# EAGLE design MSSRP-Temperature_System_beta (EAGLE 6.6.0)
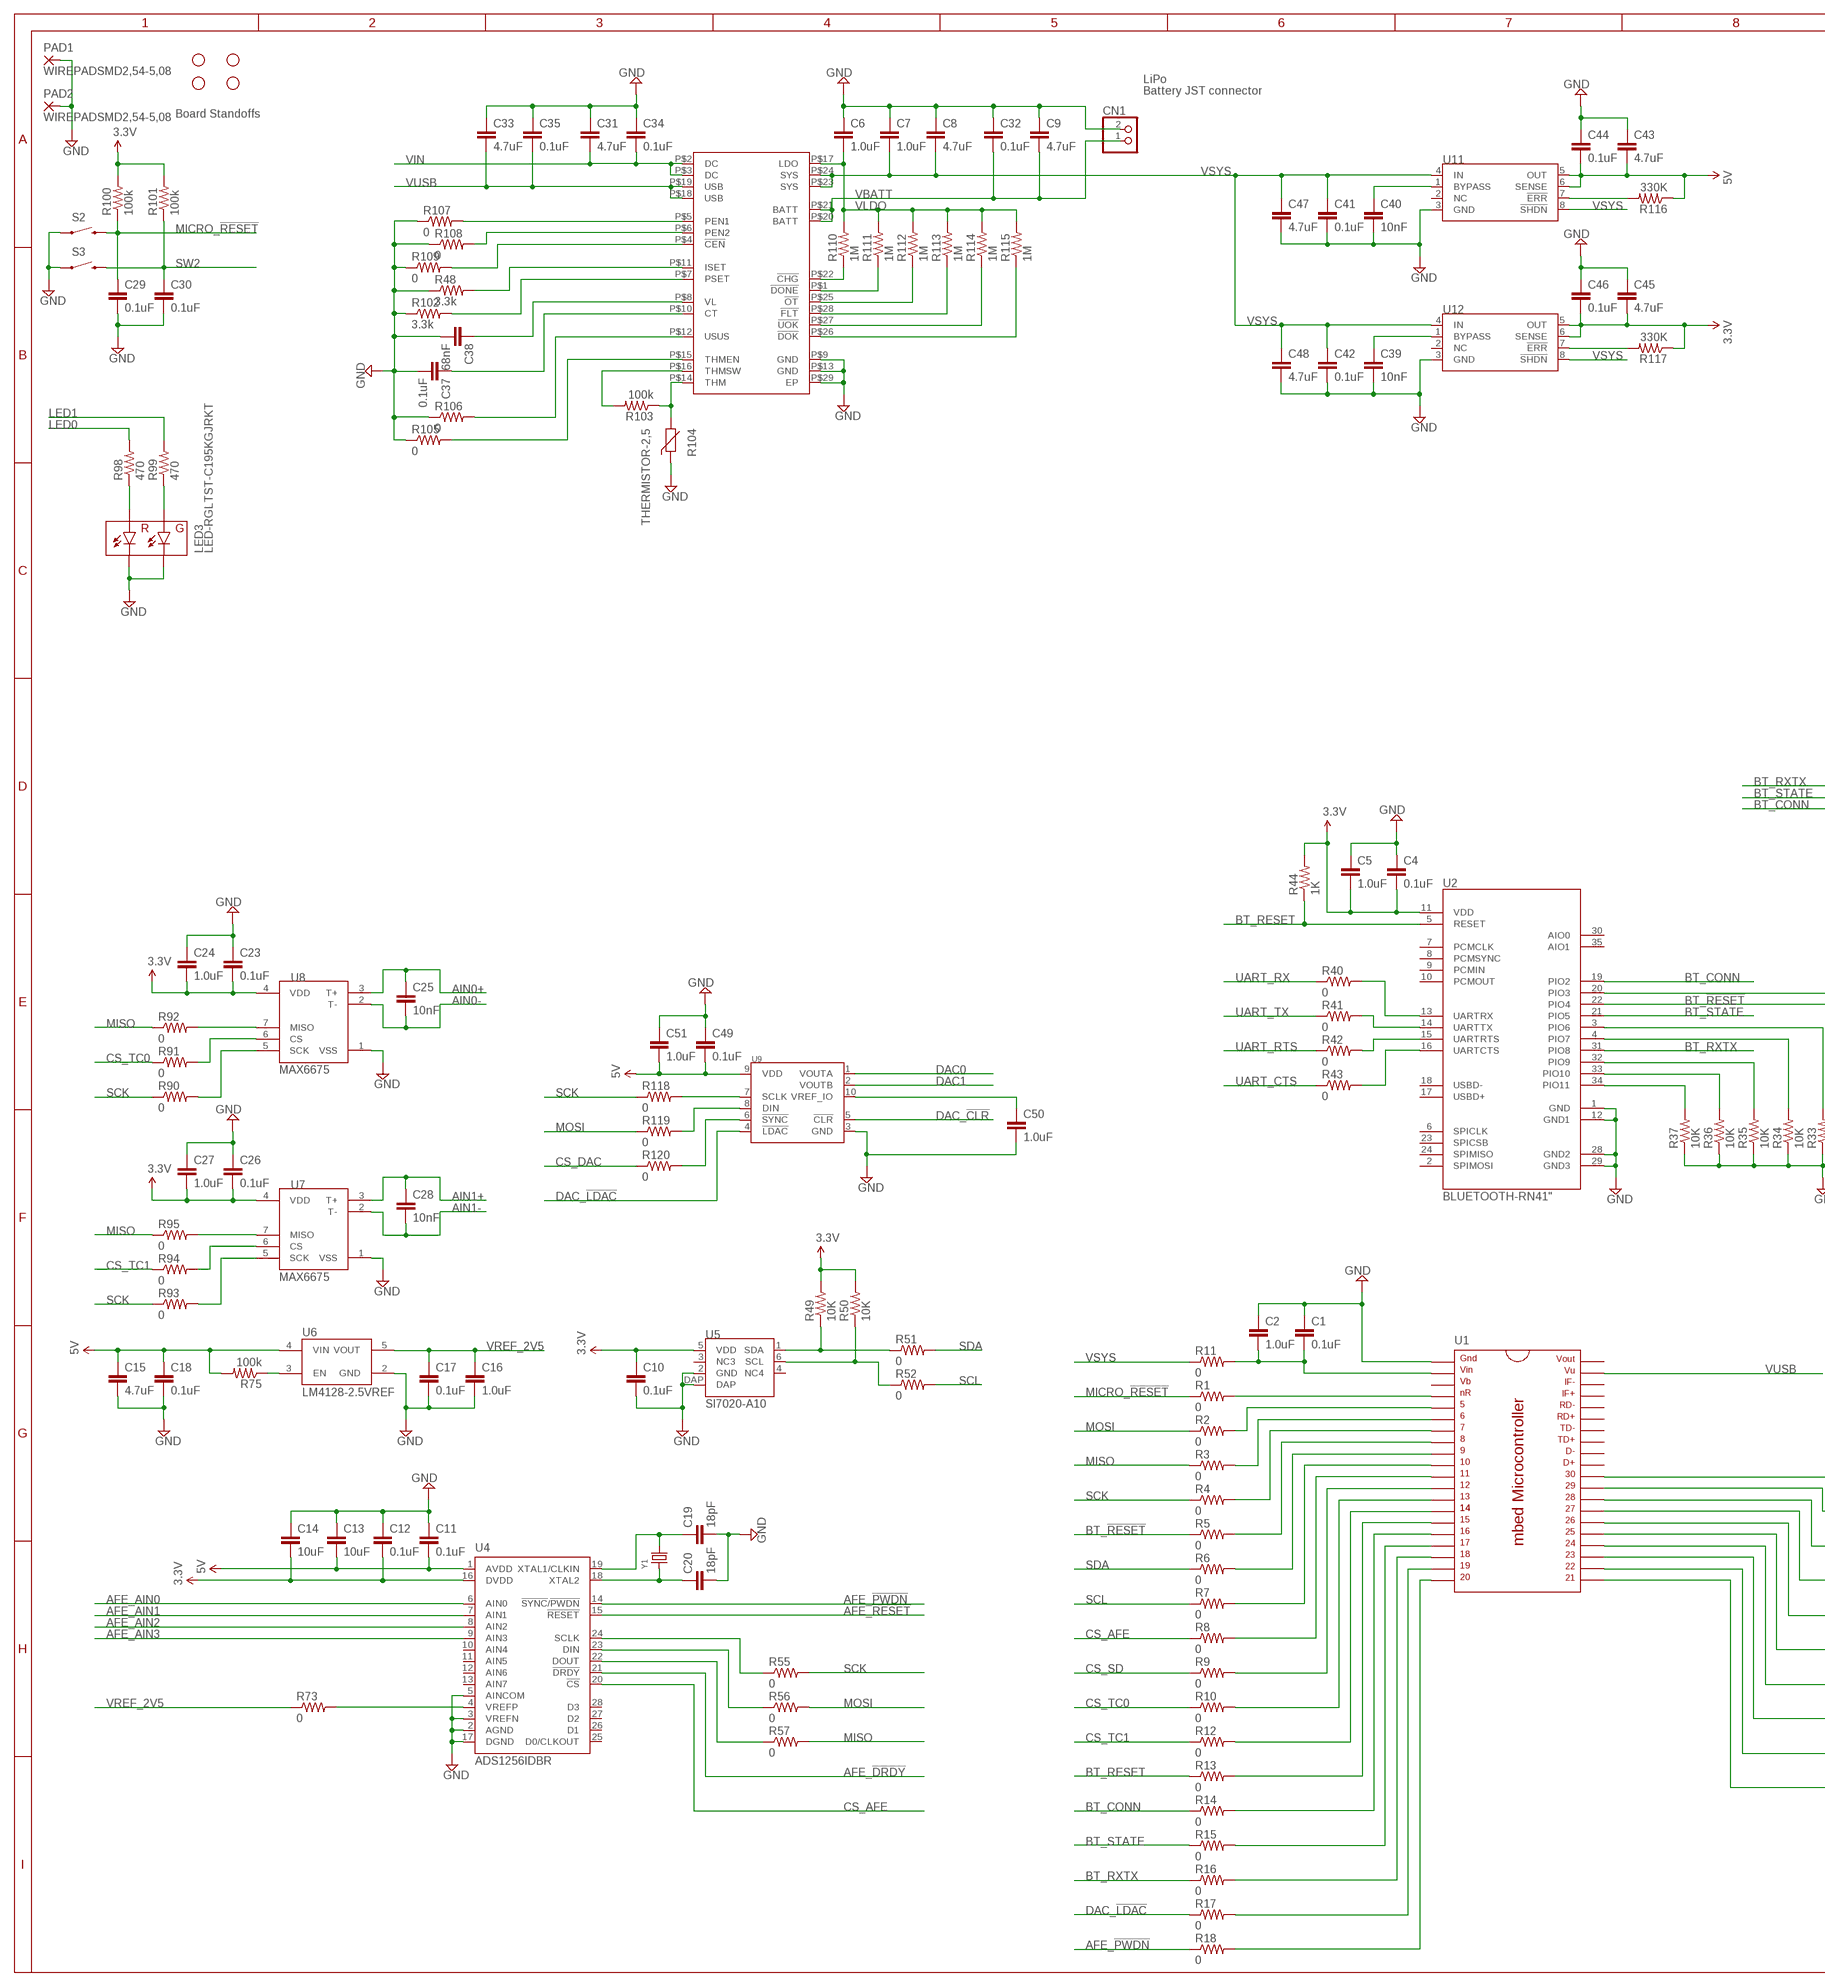
[diagram p0: schematic, sheet 1, part 1 of 2]
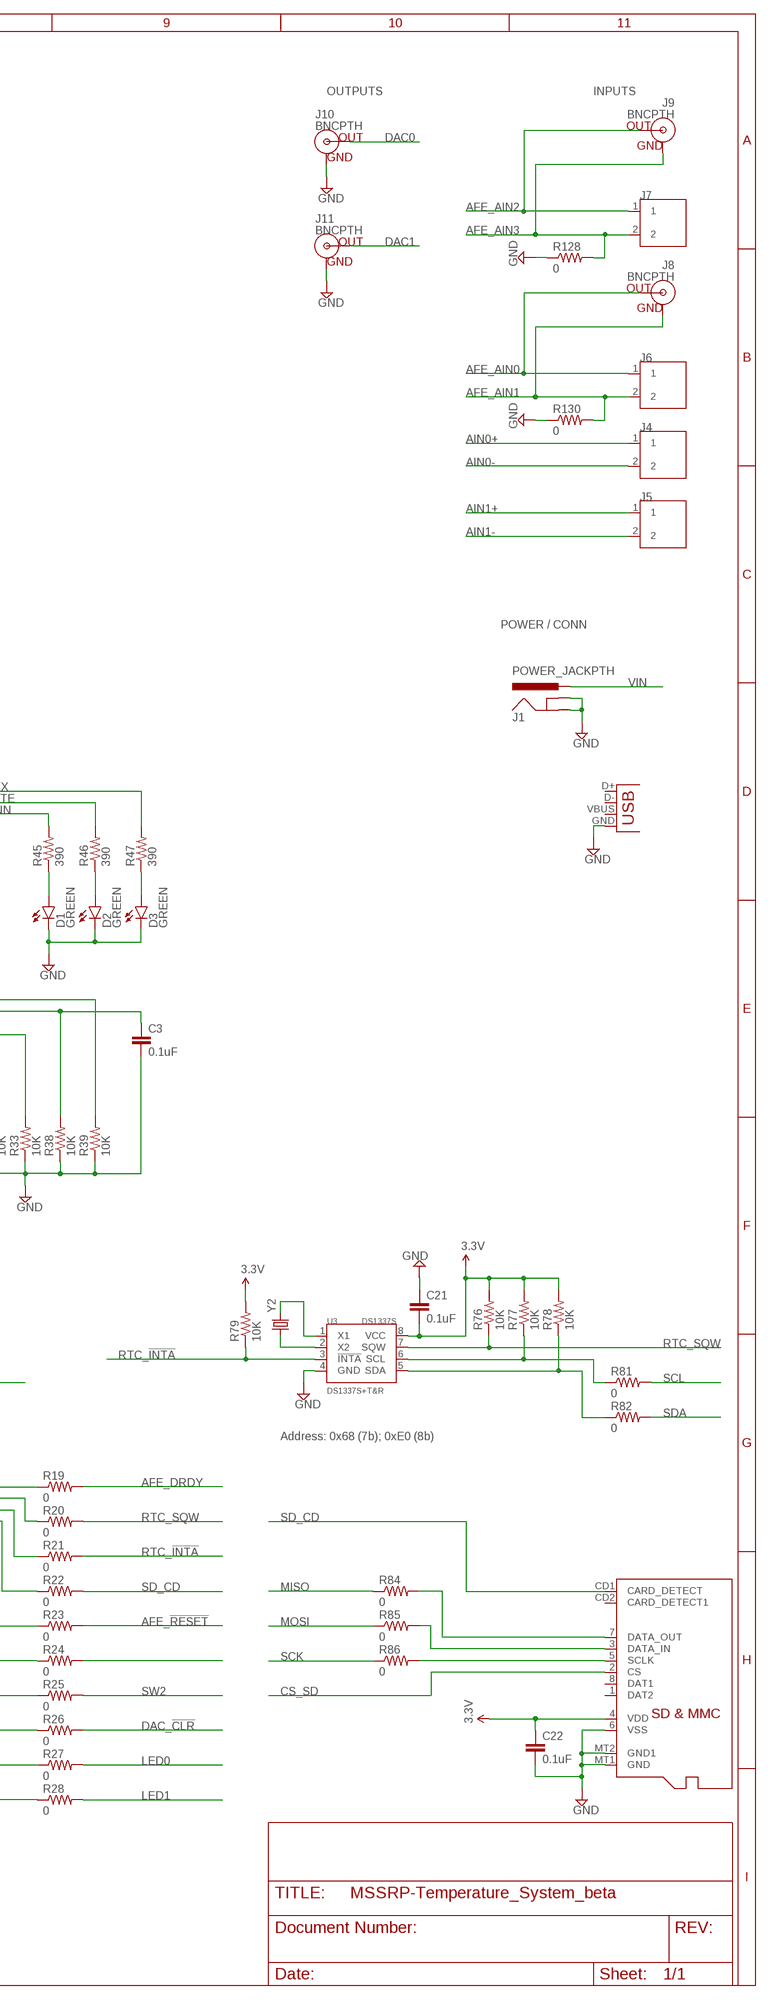
[diagram p1: schematic, sheet 1, part 2 of 2]

## Parts
C1  0.1uF  0.1UF-25V-5%(0603)  [0603-CAP]
C2  1.0uF  1.0UF-16V-10%(0603)  [0603-CAP]
C3  0.1uF  0.1UF-25V-5%(0603)  [0603-CAP]
C4  0.1uF  0.1UF-25V-5%(0603)  [0603-CAP]
C5  1.0uF  1.0UF-16V-10%(0603)  [0603-CAP]
C6  1.0uF  1.0UF-16V-10%(0603)  [0603-CAP]
C7  1.0uF  1.0UF-16V-10%(0603)  [0603-CAP]
C8  4.7uF  4.7UF-6.3V-10%(0603)0603  [0603-CAP]
C9  4.7uF  4.7UF-6.3V-10%(0603)0603  [0603-CAP]
C10  0.1uF  0.1UF-25V-5%(0603)  [0603-CAP]
C11  0.1uF  0.1UF-25V-5%(0603)  [0603-CAP]
C12  0.1uF  0.1UF-25V-5%(0603)  [0603-CAP]
C13  10uF  10UF-6.3V-20%(0603)  [0603-CAP]
C14  10uF  10UF-6.3V-20%(0603)  [0603-CAP]
C15  4.7uF  4.7UF-6.3V-10%(0603)0603  [0603-CAP]
C16  1.0uF  1.0UF-16V-10%(0603)  [0603-CAP]
C17  0.1uF  0.1UF-25V-5%(0603)  [0603-CAP]
C18  0.1uF  0.1UF-25V-5%(0603)  [0603-CAP]
C19  18pF  18PF-50V-5%(0603)  [0603-CAP]
C20  18pF  18PF-50V-5%(0603)  [0603-CAP]
C21  0.1uF  0.1UF-25V-5%(0603)  [0603-CAP]
C22  0.1uF  0.1UF-25V-5%(0603)  [0603-CAP]
C23  0.1uF  0.1UF-25V-5%(0603)  [0603-CAP]
C24  1.0uF  1.0UF-16V-10%(0603)  [0603-CAP]
C25  10nF  10NF/10000PF-50V-10%(0603)  [0603-CAP]
C26  0.1uF  0.1UF-25V-5%(0603)  [0603-CAP]
C27  1.0uF  1.0UF-16V-10%(0603)  [0603-CAP]
C28  10nF  10NF/10000PF-50V-10%(0603)  [0603-CAP]
C29  0.1uF  0.1UF-25V-5%(0603)  [0603-CAP]
C30  0.1uF  0.1UF-25V-5%(0603)  [0603-CAP]
C31  4.7uF  4.7UF-6.3V-10%(0603)0603  [0603-CAP]
C32  0.1uF  0.1UF-25V-5%(0603)  [0603-CAP]
C33  4.7uF  4.7UF-6.3V-10%(0603)0603  [0603-CAP]
C34  0.1uF  0.1UF-25V-5%(0603)  [0603-CAP]
C35  0.1uF  0.1UF-25V-5%(0603)  [0603-CAP]
C37  0.1uF  0.1UF-25V-5%(0603)  [0603-CAP]
C38  68nF  0.1UF-25V-5%(0603)  [0603-CAP]
C39  10nF  10NF/10000PF-50V-10%(0603)  [0603-CAP]
C40  10nF  10NF/10000PF-50V-10%(0603)  [0603-CAP]
C41  0.1uF  0.1UF-25V-5%(0603)  [0603-CAP]
C42  0.1uF  0.1UF-25V-5%(0603)  [0603-CAP]
C43  4.7uF  4.7UF-6.3V-10%(0603)0603  [0603-CAP]
C44  0.1uF  0.1UF-25V-5%(0603)  [0603-CAP]
C45  4.7uF  4.7UF-6.3V-10%(0603)0603  [0603-CAP]
C46  0.1uF  0.1UF-25V-5%(0603)  [0603-CAP]
C47  4.7uF  4.7UF-6.3V-10%(0603)0603  [0603-CAP]
C48  4.7uF  4.7UF-6.3V-10%(0603)0603  [0603-CAP]
C49  0.1uF  0.1UF-25V-5%(0603)  [0603-CAP]
C50  1.0uF  1.0UF-16V-10%(0603)  [0603-CAP]
C51  1.0uF  1.0UF-16V-10%(0603)  [0603-CAP]
CN1  JST_2PIN-THM-RA  [JST-PH-2-THM-RA]
D1  GREEN  LED-GREEN0603  [LED-0603]
D2  GREEN  LED-GREEN0603  [LED-0603]
D3  GREEN  LED-GREEN0603  [LED-0603]
J1  POWER_JACKPTH  [POWER_JACK_PTH]
J2  USBSMD  [USB-MINIB]
J4  TE-2-TERMBLOCK  [TE-2-TERMBLOCK]
J5  TE-2-TERMBLOCK  [TE-2-TERMBLOCK]
J6  TE-2-TERMBLOCK  [TE-2-TERMBLOCK]
J7  TE-2-TERMBLOCK  [TE-2-TERMBLOCK]
J8  BNCPTH  [BNC]
J9  BNCPTH  [BNC]
J10  BNCPTH  [BNC]
J11  BNCPTH  [BNC]
LED3  LED-RGLTST-C195KGJRKT  [LTST-C195KGJRKT]
PAD1  WIREPADSMD2,54-5,08  [SMD2,54-5,08]
PAD2  WIREPADSMD2,54-5,08  [SMD2,54-5,08]
R1  0  0OHM1/10W5%(0603)  [0603]
R2  0  0OHM1/10W5%(0603)  [0603]
R3  0  0OHM1/10W5%(0603)  [0603]
R4  0  0OHM1/10W5%(0603)  [0603]
R5  0  0OHM1/10W5%(0603)  [0603]
R6  0  0OHM1/10W5%(0603)  [0603]
R7  0  0OHM1/10W5%(0603)  [0603]
R8  0  0OHM1/10W5%(0603)  [0603]
R9  0  0OHM1/10W5%(0603)  [0603]
R10  0  0OHM1/10W5%(0603)  [0603]
R11  0  0OHM1/10W5%(0603)  [0603]
R12  0  0OHM1/10W5%(0603)  [0603]
R13  0  0OHM1/10W5%(0603)  [0603]
R14  0  0OHM1/10W5%(0603)  [0603]
R15  0  0OHM1/10W5%(0603)  [0603]
R16  0  0OHM1/10W5%(0603)  [0603]
R17  0  0OHM1/10W5%(0603)  [0603]
R18  0  0OHM1/10W5%(0603)  [0603]
R19  0  0OHM1/10W5%(0603)  [0603]
R20  0  0OHM1/10W5%(0603)  [0603]
R21  0  0OHM1/10W5%(0603)  [0603]
R22  0  0OHM1/10W5%(0603)  [0603]
R23  0  0OHM1/10W5%(0603)  [0603]
R24  0  0OHM1/10W5%(0603)  [0603]
R25  0  0OHM1/10W5%(0603)  [0603]
R26  0  0OHM1/10W5%(0603)  [0603]
R27  0  0OHM1/10W5%(0603)  [0603]
R28  0  0OHM1/10W5%(0603)  [0603]
R33  10K  10KOHM1/10W1%(0603)0603  [0603-RES]
R34  10K  10KOHM1/10W1%(0603)0603  [0603-RES]
R35  10K  10KOHM1/10W1%(0603)0603  [0603-RES]
R36  10K  10KOHM1/10W1%(0603)0603  [0603-RES]
R37  10K  10KOHM1/10W1%(0603)0603  [0603-RES]
R38  10K  10KOHM1/10W1%(0603)0603  [0603-RES]
R39  10K  10KOHM1/10W1%(0603)0603  [0603-RES]
R40  0  0OHM1/10W5%(0603)  [0603]
R41  0  0OHM1/10W5%(0603)  [0603]
R42  0  0OHM1/10W5%(0603)  [0603]
R43  0  0OHM1/10W5%(0603)  [0603]
R44  1K  1KOHM1/10W1%(0603)  [0603-RES]
R45  390  390OHM1/10W1%(0603)  [0603-RES]
R46  390  390OHM1/10W1%(0603)  [0603-RES]
R47  390  390OHM1/10W1%(0603)  [0603-RES]
R48  3.3k  3.3MOHM-1/10W-1%(0603)  [0603-RES]
R49  10K  10KOHM1/10W1%(0603)0603  [0603-RES]
R50  10K  10KOHM1/10W1%(0603)0603  [0603-RES]
R51  0  0OHM1/10W5%(0603)  [0603]
R52  0  0OHM1/10W5%(0603)  [0603]
R55  0  0OHM1/10W5%(0603)  [0603]
R56  0  0OHM1/10W5%(0603)  [0603]
R57  0  0OHM1/10W5%(0603)  [0603]
R73  0  0OHM1/10W5%(0603)  [0603]
R75  100k  100KOHM1/10W1%(0603)  [0603-RES]
R76  10K  10KOHM1/10W1%(0603)0603  [0603-RES]
R77  10K  10KOHM1/10W1%(0603)0603  [0603-RES]
R78  10K  10KOHM1/10W1%(0603)0603  [0603-RES]
R79  10K  10KOHM1/10W1%(0603)0603  [0603-RES]
R81  0  0OHM1/10W5%(0603)  [0603]
R82  0  0OHM1/10W5%(0603)  [0603]
R84  0  0OHM1/10W5%(0603)  [0603]
R85  0  0OHM1/10W5%(0603)  [0603]
R86  0  0OHM1/10W5%(0603)  [0603]
R90  0  0OHM1/10W5%(0603)  [0603]
R91  0  0OHM1/10W5%(0603)  [0603]
R92  0  0OHM1/10W5%(0603)  [0603]
R93  0  0OHM1/10W5%(0603)  [0603]
R94  0  0OHM1/10W5%(0603)  [0603]
R95  0  0OHM1/10W5%(0603)  [0603]
R98  470  470OHM1/10W1%(0603)  [0603-RES]
R99  470  470OHM1/10W1%(0603)  [0603-RES]
R100  100k  100KOHM1/10W1%(0603)  [0603-RES]
R101  100k  100KOHM1/10W1%(0603)  [0603-RES]
R102  3.3k  3.3MOHM-1/10W-1%(0603)  [0603-RES]
R103  100k  100OHM1/10W1%(0603)  [0603-RES]
R104  THERMISTOR-2,5  [RS-2,5]
R105  0  0OHM1/10W5%(0603)  [0603]
R106  0  0OHM1/10W5%(0603)  [0603]
R107  0  0OHM1/10W5%(0603)  [0603]
R108  0  0OHM1/10W5%(0603)  [0603]
R109  0  0OHM1/10W5%(0603)  [0603]
R110  1M  330KOHM1/10W1%(0603)0603  [0603-RES]
R111  1M  330KOHM1/10W1%(0603)0603  [0603-RES]
R112  1M  330KOHM1/10W1%(0603)0603  [0603-RES]
R113  1M  330KOHM1/10W1%(0603)0603  [0603-RES]
R114  1M  330KOHM1/10W1%(0603)0603  [0603-RES]
R115  1M  330KOHM1/10W1%(0603)0603  [0603-RES]
R116  330K  330KOHM1/10W1%(0603)0603  [0603-RES]
R117  330K  330KOHM1/10W1%(0603)0603  [0603-RES]
R118  0  0OHM1/10W5%(0603)  [0603]
R119  0  0OHM1/10W5%(0603)  [0603]
R120  0  0OHM1/10W5%(0603)  [0603]
R128  0  0OHM1/10W5%(0603)  [0603]
R130  0  0OHM1/10W5%(0603)  [0603]
S2  SWITCH-MOMENTARY-2-SMD-1101NE  [TACTILE-SWITCH-1101NE]
S3  SWITCH-MOMENTARY-2-SMD-1101NE  [TACTILE-SWITCH-1101NE]
STANDOFF1  STAND-OFF  [STAND-OFF]
STANDOFF2  STAND-OFF  [STAND-OFF]
STANDOFF3  STAND-OFF  [STAND-OFF]
STANDOFF4  STAND-OFF  [STAND-OFF]
U1  MBED  [DIL40_0.9]
U2  BLUETOOTH-RN41"  [RN41]
U3  DS1337S+T&R  [SOIC8]
U4  ADS1256IDBR  [SSOP28]
U5  SI7020-A10  [DFN6]
U6  LM4128-2.5VREF  [SOT23-5]
U7  MAX6675  [SO08-MAX6675]
U8  MAX6675  [SO08-MAX6675]
U9  DAC7562  [MSOP10]
U10  MAX8934A  [QFN28]
U11  LP2989AIM  [SOIC8]
U12  LP2989AIM  [SOIC8]
U$1  MICROSD  [MICROSD]
Y1  CRYSTALSMD  [HC49UP]
Y2  CRYSTALSMD  [HC49UP]

## Nets
3.3V: C4.2 C5.2 C10.1 C12.2 C14.2 C21.2 C22.1 C23.2 C24.2 C26.2 C27.2 C45.2 C46.2 R44.2 R49.2 R50.2 R76.2 R77.2 R78.2 R79.2 R100.2 R101.2 R117.1 U2.11(VDD) U3.8(VCC) U4.16(DVDD) U5.5(VDD) U7.4(VDD) U8.4(VDD) U12.5(OUT) U12.6(SENSE) U$1.4(VDD)
5V: C11.2 C13.2 C15.1 C18.1 C43.2 C44.2 C49.2 C51.2 R75.2 R116.1 U4.1(AVDD) U6.4(VIN) U9.9(VDD) U11.5(OUT) U11.6(SENSE)
AFE_!DRDY: U4.21(!DRDY)
AFE_!PWDN: R18.1 U4.14(!SYNC!/!PWDN)
AFE_!RESET: R23.2 U4.15(!RESET)
AFE_AIN0: J6.1 J8.S(OUT) U4.6(AIN0)
AFE_AIN1: J6.2 J8.GND R130.2 U4.7(AIN1)
AFE_AIN2: J7.1 J9.S(OUT) U4.8(AIN2)
AFE_AIN3: J7.2 J9.GND R128.2 U4.9(AIN3)
AFE_DRDY: R19.2
AIN0+: C25.1 J4.1 U8.3(T+)
AIN0-: C25.2 J4.2 U8.2(T-)
AIN1+: C28.1 J5.1 U7.3(T+)
AIN1-: C28.2 J5.2 U7.2(T-)
BT_!RESET: C3.1 R5.1 R38.2 U2.22(PIO4)
BT_CONN: R14.1 R45.2 U2.19(PIO2)
BT_RESET: R13.1 R44.1 U2.5(RESET)
BT_RXTX: R16.1 R47.2 U2.31(PIO8)
BT_STATE: R15.1 R46.2 U2.21(PIO5)
CS_AFE: R8.1 U4.20(!CS)
CS_DAC: R120.1
CS_SD: R9.1 U$1.2(CS)
CS_TC0: R10.1 R91.1
CS_TC1: R12.1 R94.1
DAC0: J10.S(OUT) U9.1(VOUTA)
DAC1: J11.S(OUT) U9.2(VOUTB)
DAC_!CLR: R26.2 U9.5(!CLR)
DAC_!LDAC: R17.1 U9.4(!LDAC)
GND: C1.1 C2.1 C3.2 C4.1 C5.1 C6.1 C7.1 C8.1 C9.1 C10.2 C11.1 C12.1 C13.1 C14.1 C15.2 C16.2 C17.2 C18.2 C19.2 C20.2 C21.1 C22.2 C23.1 C24.1 C26.1 C27.1 C29.2 C30.2 C31.1 C32.1 C33.1 C34.1 C35.1 C37.2 C38.2 C39.2 C40.2 C41.2 C42.2 C43.1 C44.1 C45.1 C46.1 C47.2 C48.2 C49.1 C50.2 C51.1 CN1.2 D1.C D2.C D3.C J1.GND J1.GNDBREAK J2.GND J10.GND J11.GND LED3.P$3(GC) LED3.P$4(RC) PAD1.1(P) PAD2.1(P) R33.1 R34.1 R35.1 R36.1 R37.1 R38.1 R39.1 R48.1 R102.1 R104.1 R105.1 R106.1 R107.1 R108.1 R109.1 R128.1 R130.1 S2.P$1 S3.P$1 U1.1 U2.1(GND) U2.12(GND1) U2.28(GND2) U2.29(GND3) U3.4(GND) U4.2(AGND) U4.3(VREFN) U4.5(AINCOM) U4.17(DGND) U5.2(GND) U5.DAP U6.2(GND) U7.1(VSS) U8.1(VSS) U9.3(GND) U10.P$9(GND) U10.P$13(GND) U10.P$29(EP) U11.3(GND) U12.3(GND) U$1.6(VSS) U$1.MT1(GND) U$1.MT2(GND1)
LED0: R27.2 R98.2
LED1: R28.2 R99.2
MICRO_!RESET: C29.1 R1.1 R100.1 S2.P$2
MISO: R3.1 R57.2 R84.1 R92.1 R95.1
MOSI: R2.1 R56.2 R85.1 R119.1
N$1: R1.2 U1.4
N$2: R2.2 U1.5
N$3: R3.2 U1.6
N$4: R4.2 U1.7
N$5: R5.2 U1.8
N$6: R6.2 U1.9
N$7: R7.2 U1.10
N$8: C1.2 C2.2 R11.2 U1.2
N$9: R8.2 U1.11
N$10: R9.2 U1.12
N$11: R10.2 U1.13
N$12: R12.2 U1.14
N$13: R19.1 U1.30
N$14: R13.2 U1.15
N$15: R20.1 U1.29
N$16: R21.1 U1.28
N$17: R22.1 U1.27
N$18: R23.1 U1.26
N$19: R24.1 U1.25
N$20: R14.2 U1.16
N$21: R15.2 U1.17
N$22: R16.2 U1.18
N$23: R17.2 U1.19
N$24: R18.2 U1.20
N$25: R25.1 U1.24
N$26: R26.1 U1.23
N$27: R27.1 U1.22
N$28: R28.1 U1.21
N$30: R24.2
N$33: R34.2 U2.4(PIO7)
N$34: R33.2 U2.3(PIO6)
N$35: R35.2 U2.32(PIO9)
N$36: R36.2 U2.33(PIO10)
N$37: R37.2 U2.34(PIO11)
N$39: R39.2 U2.20(PIO3)
N$40: R41.2 U2.14(UARTTX)
N$41: R42.2 U2.15(UARTRTS)
N$42: R43.2 U2.16(UARTCTS)
N$43: R40.2 U2.13(UARTRX)
N$44: D1.A R45.1
N$45: D2.A R46.1
N$46: D3.A R47.1
N$47: R49.1 R51.1 U5.1(SDA)
N$48: R50.1 R52.1 U5.6(SCL)
N$51: R55.1 U4.24(SCLK)
N$52: R56.1 U4.23(DIN)
N$53: R57.1 U4.22(DOUT)
N$69: R73.2 U4.4(VREFP)
N$71: R75.1 U6.3(EN)
N$72: C20.1 U4.18(XTAL2) Y1.1
N$73: C19.1 U4.19(XTAL1/CLKIN) Y1.2
N$74: U3.2(X2) Y2.1
N$75: U3.1(X1) Y2.2
N$77: R77.1 R81.1 U3.6(SCL)
N$78: R78.1 R82.1 U3.5(SDA)
N$81: R86.2 U$1.5(SCLK)
N$82: R85.2 U$1.3(DATA_IN)
N$83: R84.2 U$1.7(DATA_OUT)
N$86: R92.2 U8.7(MISO)
N$87: R91.2 U8.6(CS)
N$88: R90.2 U8.5(SCK)
N$89: R95.2 U7.7(MISO)
N$90: R94.2 U7.6(CS)
N$91: R93.2 U7.5(SCK)
N$92: LED3.P$2(RA) R98.1
N$93: LED3.P$1(GA) R99.1
N$97: R103.1 R104.2 U10.P$14(THM)
N$98: R103.2 U10.P$16(THMSW)
N$99: R105.2 U10.P$15(THMEN)
N$100: R106.2 U10.P$12(USUS)
N$101: R107.2 U10.P$5(PEN1)
N$102: R108.2 U10.P$6(PEN2)
N$103: R109.2 U10.P$4(!CEN)
N$104: R48.2 U10.P$11(ISET)
N$105: R102.2 U10.P$7(PSET)
N$106: C38.1 U10.P$8(VL)
N$107: C37.1 U10.P$10(CT)
N$109: R110.1 U10.P$22(!CHG)
N$110: R111.1 U10.P$1(!DONE)
N$111: R112.1 U10.P$25(!OT)
N$112: R113.1 U10.P$28(!FLT)
N$113: R114.1 U10.P$27(!UOK)
N$114: R115.1 U10.P$26(!DOK)
N$115: C40.1 U11.1(BYPASS)
N$116: C39.1 U12.1(BYPASS)
N$117: R116.2 U11.7(!ERR)
N$118: R117.2 U12.7(!ERR)
N$119: R118.2 U9.7(SCLK)
N$120: R119.2 U9.8(DIN)
N$121: R120.2 U9.6(!SYNC)
N$124: C50.1 U9.10(VREF_IO)
RTC_!INTA: R21.2 R79.1 U3.3(!INTA)
RTC_SQW: R20.2 R76.1 U3.7(SQW)
SCK: R4.1 R55.2 R86.1 R90.1 R93.1 R118.1
SCL: R7.1 R52.2 R81.2
SD_CD: R22.2 U$1.CD1(CARD_DETECT)
SDA: R6.1 R51.2 R82.2
SW2: C30.1 R25.2 R101.1 S3.P$2
UART_CTS: R43.1
UART_RTS: R42.1
UART_RX: R40.1
UART_TX: R41.1
VBATT: C9.2 C32.2 CN1.1 U10.P$20(BATT) U10.P$21(BATT)
VIN: C31.2 C34.2 J1.PWR U10.P$2(DC) U10.P$3(DC)
VLDO: C6.2 R110.2 R111.2 R112.2 R113.2 R114.2 R115.2 U10.P$17(LDO)
VREF_2V5: C16.1 C17.1 R73.1 U6.5(VOUT)
VSYS: C7.2 C8.2 C41.1 C42.1 C47.1 C48.1 R11.1 U10.P$23(SYS) U10.P$24(SYS) U11.4(IN) U11.8(!SHDN) U12.4(IN) U12.8(!SHDN)
VUSB: C33.2 C35.2 U1.39 U10.P$18(USB) U10.P$19(USB)
Unconnected: J2.D+ J2.D- J2.VBUS U1.3 U1.31 U1.32 U1.33 U1.34 U1.35 U1.36 U1.37 U1.38 U1.40 U2.2(SPIMOSI) U2.6(SPICLK) U2.7(PCMCLK) U2.8(PCMSYNC) U2.9(PCMIN) U2.10(PCMOUT) U2.17(USBD+) U2.18(USBD-) U2.23(SPICSB) U2.24(SPIMISO) U2.30(AIO0) U2.35(AIO1) U4.10(AIN4) U4.11(AIN5) U4.12(AIN6) U4.13(AIN7) U4.25(D0/CLKOUT) U4.26(D1) U4.27(D2) U4.28(D3) U5.3(NC3) U5.4(NC4) U11.2(NC) U12.2(NC) U$1.1(DAT2) U$1.8(DAT1) U$1.CD2(CARD_DETECT1)

## Notes on the sheet
- LiPo
- Battery JST connector | OUTPUTS | INPUTS
- Board Standoffs
- POWER / CONN
- Address: 0x68 (7b); 0xE0 (8b)

## Library data of the parts
C1 C3 C4 C10-C12 C17 C18 C21-C23 C26 C29 C30 C32 C34 C35 C37 C41 C42 C44 C46 C49 = SparkFun-Capacitors:0.1UF-25V-5%(0603): CAP-08604; PROD_ID: CAP-08604
C2 C5-C7 C16 C24 C27 C50 C51 = SparkFun-Capacitors:1.0UF-16V-10%(0603): CAP-00868; PROD_ID: CAP-00868
C8 C9 C15 C31 C33 C43 C45 C47 C48 = SparkFun-Capacitors:4.7UF-6.3V-10%(0603): CAP-08280; PROD_ID: CAP-08280
C13 C14 = SparkFun-Capacitors:10UF-6.3V-20%(0603): CAP-11015; PROD_ID: CAP-11015
C19 C20 = SparkFun-Capacitors:18PF-50V-5%(0603): CAP-08267; PROD_ID: CAP-08267
C25 C28 C39 C40 = SparkFun-Capacitors:10NF/10000PF-50V-10%(0603): CAP-00867; PROD_ID: CAP-00867
C38 = SparkFun-Capacitors:0.1UF-25V-5%(0603): CAP-08604; PROD_ID: CAP-08604; VALUE: 0.1uF
CN1 = adafruit:JST_2PIN: JST 2-Pin Connectors of various flavors SMT-RA (S2B-PH-SM4) 4UConnector #17311 SMT (B2B-PH-SM4) THM-RA (S2B-PH) THM (B2B-PH)
D1-D3 = SparkFun-LED:LED-GREEN: Various green LEDs Green LEDs used in SFE Production 0603- DIO-00821 LARGE- DIO-00862 LILYPAD- DIO-09910; PROD_ID: DIO-00821
J1 = SparkFun-Connectors:POWER_JACK: Power Jack This is the standard 5.5mm barrel jack for power. The PTH is the most common, proven, reliable, footprint. The Slot footprint only works if the mill layer is transmitted to the PCB fab house so be warned. Mating wall wart : TOL-00298 (and others); PROD_ID: PRT-00119
J2 = SparkFun-Connectors:USB: USB Connectors USB-B-PTH is fully proven SKU : PRT-00139/CONN-08278 USB-miniB is fully proven SKU : PRT-00587 USB-A-PCB is untested. USB-A-H is throughly reviewed, but untested. Spark Fun Electronics SKU : PRT-00437 USB-B-SMT is throughly reviewed, but untested. Needs silkscreen touching up. USB-A-S has not been used/tested USB-MB-H has not been used/tested USB-MICROB has been used. CONN-09505; PROD_ID: CONN-08193
J4-J7 = MSSRP-Lib:TE-2-TERMBLOCK
J8-J11 = SparkFun-Connectors:BNC: BNC Connector, Mouser Part# 5227161
LED3 = SparkFun-LED:LED-RG; PROD_ID: DIO-12140
PAD1 PAD2 = wirepad:WIREPAD: Wire PAD connect wire on PCB
R1-R28 R40-R43 R51 R52 R55-R57 R73 R81 R82 R84-R86 R90-R95 R105-R109 R118-R120 R128 R130 = SparkFun-Resistors:0OHM1/10W5%(0603): RES-08609; PROD_ID: RES-08609
R33-R39 R49 R50 R76-R79 = SparkFun-Resistors:10KOHM1/10W1%(0603): RES-00824; PROD_ID: RES-00824
R44 = SparkFun-Resistors:1KOHM1/10W1%(0603): RES-07856; PROD_ID: RES-07856
R45-R47 = SparkFun-Resistors:390OHM1/10W1%(0603): RES-07864; PROD_ID: RES-07864
R48 R102 = SparkFun-Resistors:3.3MOHM-1/10W-1%(0603): RES-11057; PROD_ID: RES-11057
R75 R100 R101 = SparkFun-Resistors:100KOHM1/10W1%(0603): RES-07828; PROD_ID: RES-07828
R98 R99 = SparkFun-Resistors:470OHM1/10W1%(0603): RES-07869; PROD_ID: RES-07869
R103 = SparkFun-Resistors:100OHM1/10W1%(0603): RES-07863; PROD_ID: RES-07863; VALUE: 100
R104 = varistor:THERMISTOR: THERMISTOR
R110-R115 = SparkFun-Resistors:330KOHM1/10W1%(0603): RES-08968; PROD_ID: RES-08968; VALUE: 330K
R116 R117 = SparkFun-Resistors:330KOHM1/10W1%(0603): RES-08968; PROD_ID: RES-08968
S2 S3 = SparkFun-Electromechanical:SWITCH-MOMENTARY-2: Various NO switches- pushbuttons, reed, etc
STANDOFF1-STANDOFF4 = SparkFun-Electromechanical:STAND-OFF: #4 Stand Off This is the mechanical footprint for a #4 phillips button head screw. Use the keepout ring to avoid running the screw head into surrounding components. SKU : PRT-00447
U1 = microbuilder:MBED: mbed Microcontroller, DIP40, 0.9"
U2 = SparkFun-RF:BLUETOOTH-RN41: Bluetooth SMD module
U3 = MSSRP-Lib:DS1337S+T&R
U4 = MSSRP-Lib:ADS1256
U5 = MSSRP-Lib:SI7020
U6 = SparkFun-PowerIC:LM4128-2.5VREF: .1% accurate low-current voltage reference
U7 U8 = SparkFun-AnalogIC:MAX6675: K-type thermocouple ADC, SPI output
U9 = MSSRP-Lib:DAC7562
U10 = MSSRP-Lib:MAX8934
U11 U12 = MSSRP-Lib:LP2989
U$1 = adafruit:MICROSD: Micro-SD / Transflash card holder with SPI pinout For the 3M # 2908-05WB-MG and/or 4UCON #19656 push-push type
Y1 = microbuilder:CRYSTAL: Crystals HC49UP - Surface Mount Crystal 4.0MHz 18pF +/-30ppm Surface Mount Crystal [Digikey: 535-9857-1-ND] 12.0 MHz Surface Mount Crystal [Digikey: 535-9869-6-ND] 25.0 MHz Surface Mount Crystal [Digikey: 535-9078-1-ND] 2.5 x 2.0mm - MEMs SMT Crystal 16.0 MHz 10pF 20ppm 2.5 x 2.0mm Crystal [Digikey -40-85°C: 535-10923-1-ND] 3.2 x 2.5mm - MEMs SMT Crystal 12.0 MHz 8pF 15ppm 3.2 x 2.5mm Crystal [Digikey: -10-70°C: 644-1047-1-ND -40-125°C: 644-1128-1-ND] 16.0 MHz 8pF 15ppm 3.2 x 2.5mm Crystal [Digikey: -10-70°C: 644-1049-1-ND -40-125°C: 644-1129-2-ND] 16.0 MHz 10pF 10ppm 3.2 x 2.5mm Crystal [Digikey: 644-1100-1-ND] 27.12 MHz 18pF 30ppm 3.2 x 2.5mm Crystal [Digikey: 887-1424-1-ND] 27.12MHz 10pF 10ppm 3.2 x 2.5mm Crystal [Digikey: 887-1329-1-ND] 4.9 x 1.8mm - MEMs SMT Crystal 32.768 KHz 12.5pF 20ppm 4.9 x 1.8mm Crystal [Digikey: SE2415CT-ND] 8.0 x 3.8mm - Surface Mount Crystal 32.768kHz 12.5pF 20ppm -40°C-85°C [Digikey: 535-9166-2-ND] Cylinder 32.768KHz Cylinder Crystal (2x6mm body) [Ex. Digikey: 300-8341-2-ND]
Y2 = SparkFun-FreqCtrl:CRYSTAL: Various standard crystals. Proven footprints. Spark Fun Electronics SKU : COM-00534

## Board
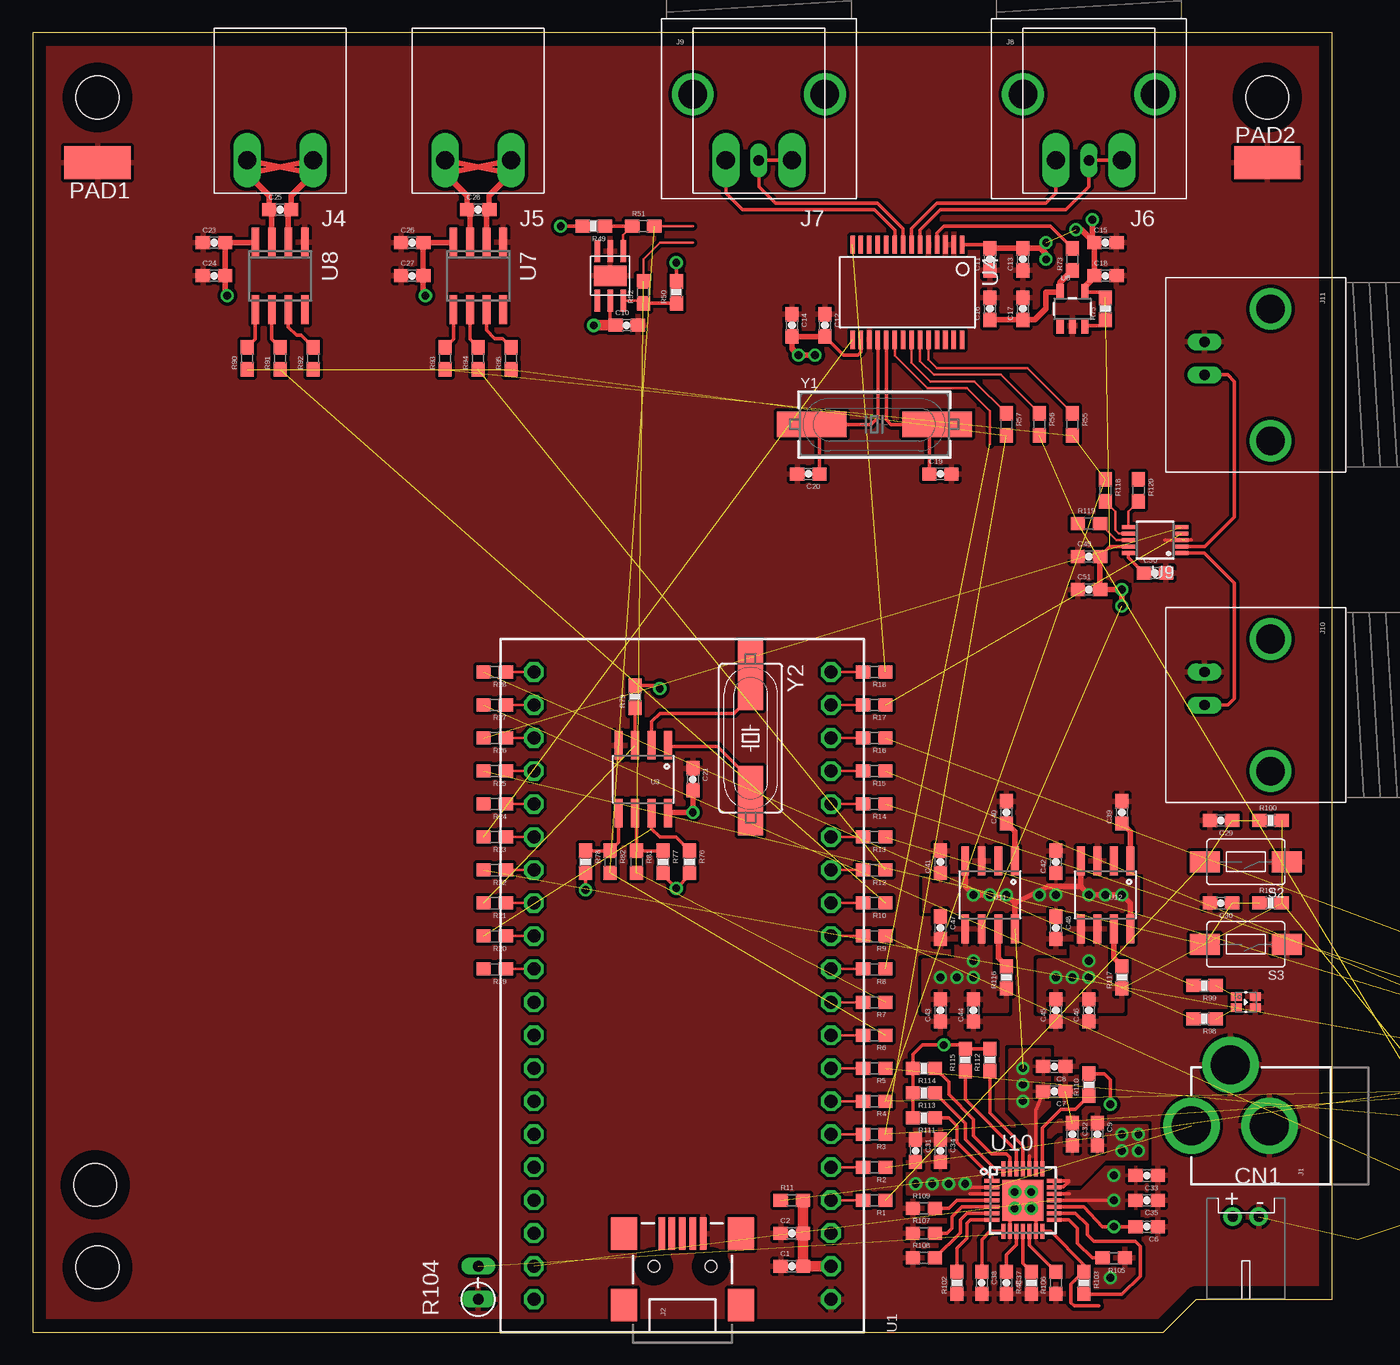
[diagram p2: board, top side]
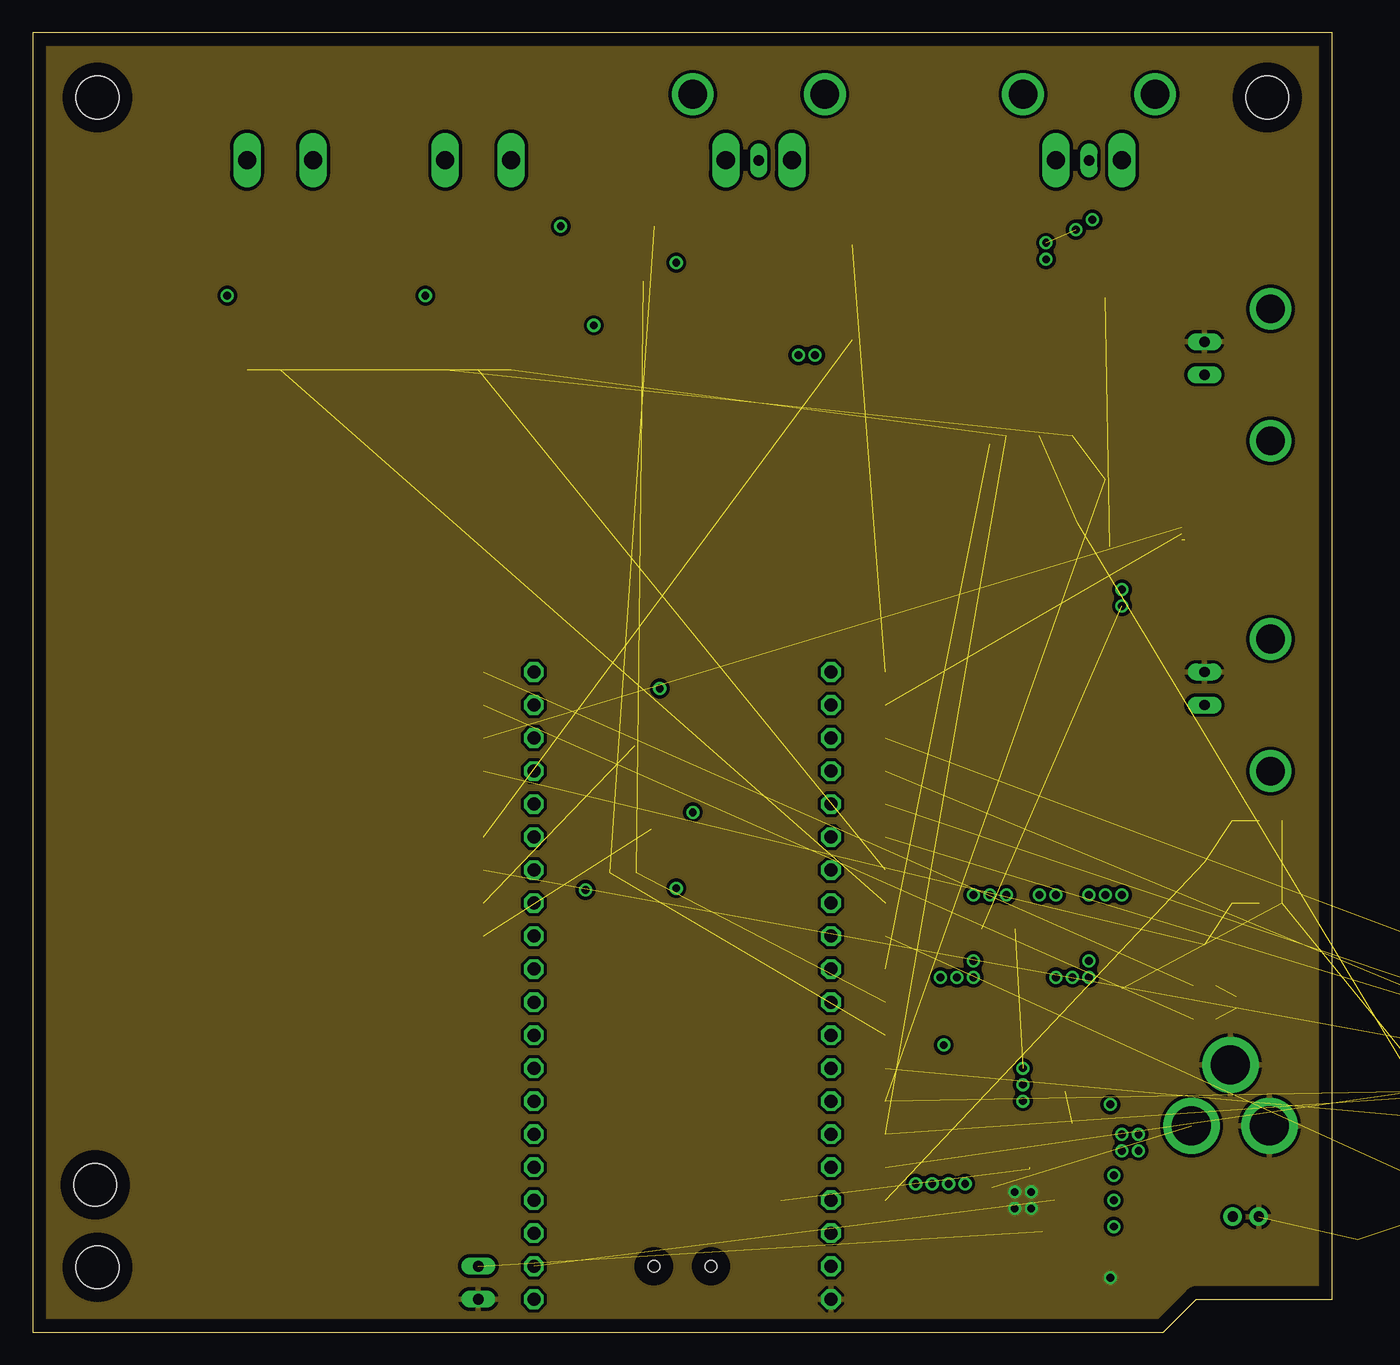
[diagram p3: board, inner layer Route2]
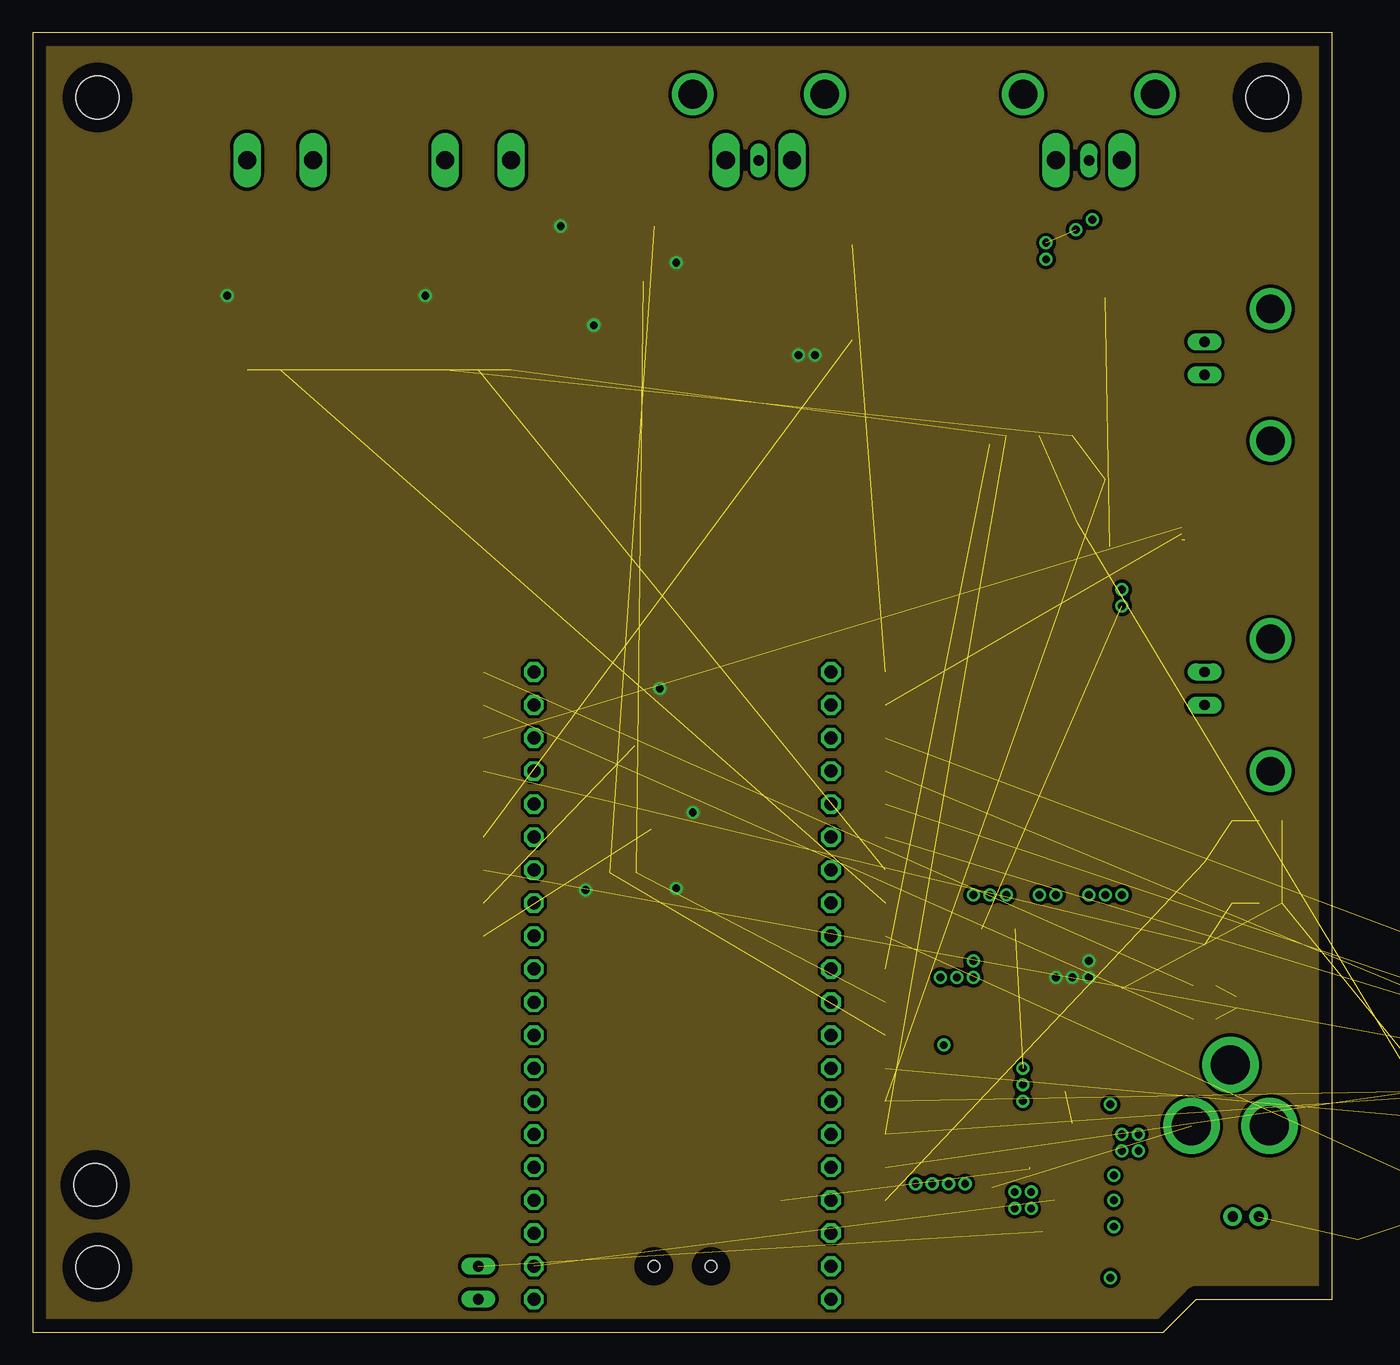
[diagram p4: board, inner layer Route15]
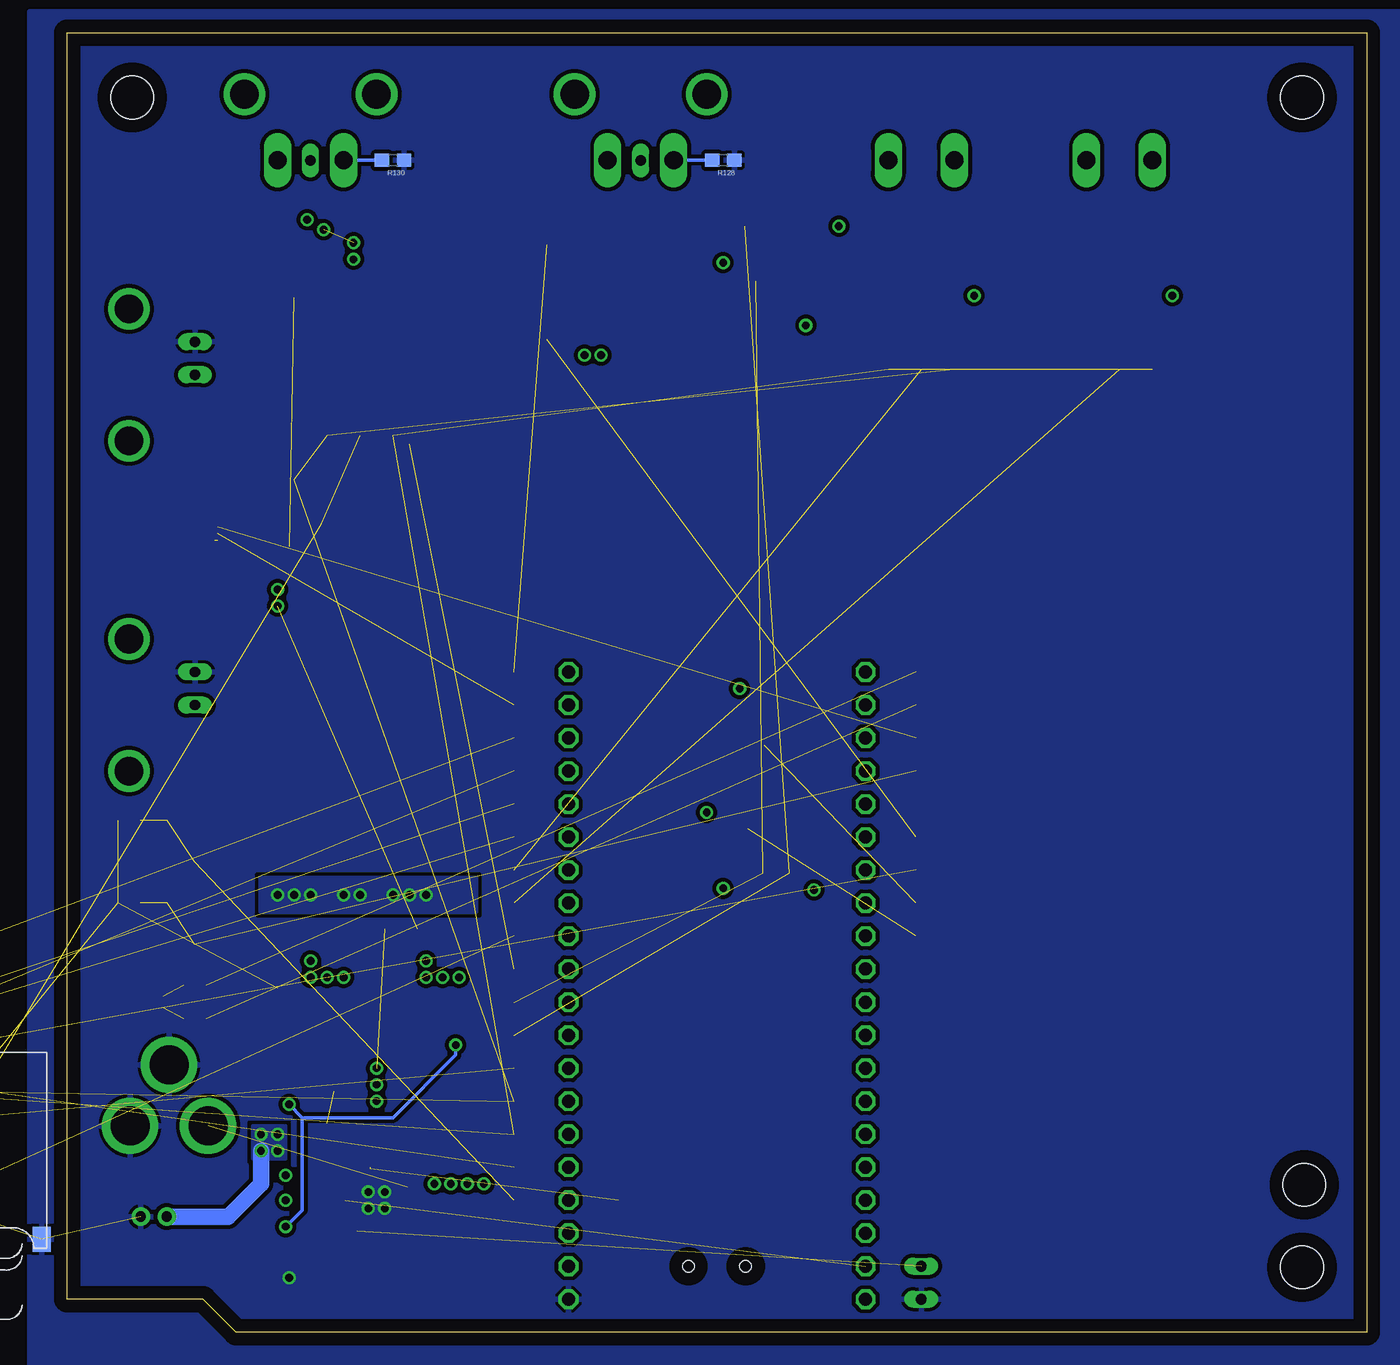
[diagram p5: board, bottom side, seen from below]

Size 100 x 100 mm. Coordinates in mm from the lower left corner, seen from the top.
Outline: 0,0 87,0 89.53,2.54 100,2.54 100,100 0,100 0,0
Copper layers (1*16): Top 0.035mm / dielectric 1.5mm / Bottom 0.035mm
Design rules "default": minimum track width 10mil, minimum drill 24mil, track to track 8mil, track to pad 8mil, pad to pad 8mil, via to via 8mil, smd to smd 8mil, copper to edge 40mil, drill to drill 8mil, minimum pad ring 10mil, minimum via ring 8mil, stop-mask expansion 4mil, vias tented up to drill 0mil, thermal gap 10mil

### Footprints (pad centres in the part's own frame; a part is rotated, then mirrored left to right if it is on the bottom)
0603-CAP = smd 1.1 x 1: 1 -0.85,0; 2 0.85,0
JST-PH-2-THM-RA = drill 0.8 pad 1.422: 1 1,0; 2 -1,0
LED-0603 = smd 1 x 1: A 0,-0.877; C 0,0.877
POWER_JACK_PTH = drill 2.997 pad 4.318: GND 0,7.7; GNDBREAK 4.7,10.7; PWR 0,13.7
USB-MINIB = smd 2.5 x 0.5: D+ 2.5,0; D- 2.5,0.8; GND 2.5,-1.6; ID 2.5,-0.8; VBUS 2.5,1.6 | smd 2.5 x 2: MTN1 -3,4.5; MTN2 2.5,4.5; MTN3 -3,-4.5; MTN4 2.5,-4.5 | hole 0.9: 0,2.2; 0,-2.2
TE-2-TERMBLOCK = drill 1.4 long: 1 -2.54,0; 2 2.54,0
BNC = drill 2.2: 3 -5.08,5.08; 4 5.08,5.08 | drill 0.8 long: GND -2.54,0; S 0,0
LTST-C195KGJRKT = smd 0.65 x 0.85: P$1 0.425,0.725; P$2 -0.425,0.725; P$3 0.425,-0.725; P$4 -0.425,-0.725
SMD2,54-5,08 = smd 2.54 x 5.08: 1 0,0
0603 = smd 1.1 x 1: 1 -0.85,0; 2 0.85,0
0603-RES = smd 1.1 x 1: 1 -0.85,0; 2 0.85,0
RS-2,5 = drill 0.813 long: 1 -1.27,0; 2 1.27,0
TACTILE-SWITCH-1101NE = smd 2.3 x 1.6: P$1 -3.15,0; P$2 3.15,0
STAND-OFF = hole 3.302: 0,0
DIL40_0.9 = drill 1 pad 1.397 octagon: 1 -22.86,-11.43; 2 -20.32,-11.43; 3 -17.78,-11.43; 4 -15.24,-11.43; 5 -12.7,-11.43; 6 -10.16,-11.43; 7 -7.62,-11.43; 8 -5.08,-11.43; 9 -2.54,-11.43; 10 0,-11.43; 11 2.54,-11.43; 12 5.08,-11.43; 13 7.62,-11.43; 14 10.16,-11.43; 15 12.7,-11.43; 16 15.24,-11.43; 17 17.78,-11.43; 18 20.32,-11.43; 19 22.86,-11.43; 20 25.4,-11.43; 21 25.4,11.43; 22 22.86,11.43; 23 20.32,11.43; 24 17.78,11.43; 25 15.24,11.43; 26 12.7,11.43; 27 10.16,11.43; 28 7.62,11.43; 29 5.08,11.43; 30 2.54,11.43; 31 0,11.43; 32 -2.54,11.43; 33 -5.08,11.43; 34 -7.62,11.43; 35 -10.16,11.43; 36 -12.7,11.43; 37 -15.24,11.43; 38 -17.78,11.43; 39 -20.32,11.43; 40 -22.86,11.43
RN41 = smd 0.8 x 1.6: 1 -6.6,-6.6; 2 -5.4,-6.6; 3 -4.2,-6.6; 4 -3,-6.6; 5 -1.8,-6.6; 6 -0.6,-6.6; 7 0.6,-6.6; 8 1.8,-6.6; 9 3,-6.6; 10 4.2,-6.6; 11 5.4,-6.6; 12 6.6,-6.6; 13 6.6,6.6; 14 5.4,6.6; 15 4.2,6.6; 16 3,6.6; 17 1.8,6.6; 18 0.6,6.6; 19 -0.6,6.6; 20 -1.8,6.6; 21 -3,6.6; 22 -4.2,6.6; 23 -5.4,6.6; 24 -6.6,6.6 | smd 1.6 x 0.8: 28 9.4,3.1; 29 9.4,-3.1; 30 9.4,4.122; 31 9.4,1.9; 32 9.4,0.7; 33 9.4,-0.7; 34 9.4,-1.9; 35 9.4,-4.122
SOIC8 = smd 0.61 x 2.21: 1 -1.905,-2.616; 2 -0.635,-2.616; 3 0.635,-2.616; 4 1.905,-2.616; 5 1.905,2.616; 6 0.635,2.616; 7 -0.635,2.616; 8 -1.905,2.616
SSOP28 = smd 0.348 x 1.397: 1 -4.225,-3.656; 2 -3.575,-3.656; 3 -2.925,-3.656; 4 -2.275,-3.656; 5 -1.625,-3.656; 6 -0.975,-3.656; 7 -0.325,-3.656; 8 0.325,-3.656; 9 0.975,-3.656; 10 1.625,-3.656; 11 2.275,-3.656; 12 2.925,-3.656; 13 3.575,-3.656; 14 4.225,-3.656; 15 4.225,3.656; 16 3.575,3.656; 17 2.925,3.656; 18 2.275,3.656; 19 1.625,3.656; 20 0.975,3.656; 21 0.325,3.656; 22 -0.325,3.656; 23 -0.975,3.656; 24 -1.625,3.656; 25 -2.275,3.656; 26 -2.925,3.656; 27 -3.575,3.656; 28 -4.225,3.656
DFN6 = smd 1.7 x 0.45: 1 -1.9,1; 2 -1.9,0; 3 -1.9,-1; 4 1.9,-1; 5 1.9,0; 6 1.9,1 | smd 1.6 x 2.5: DAP 0,0
SOT23-5 = smd 0.55 x 1.2: 1 -0.95,-1.3; 2 0,-1.3; 3 0.95,-1.3; 4 0.95,1.3; 5 -0.95,1.3
SO08-MAX6675 = smd 0.6 x 2.2: 1 -1.905,-2.6; 2 -0.635,-2.6; 3 0.635,-2.6; 4 1.905,-2.6; 5 1.905,2.6; 6 0.635,2.6; 7 -0.635,2.6; 8 -1.905,2.6
MSOP10 = smd 0.3 x 1: 1 -1,-2.05; 2 -0.5,-2.05; 3 0,-2.05; 4 0.5,-2.05; 5 1,-2.05; 6 1,2.05; 7 0.5,2.05; 8 0,2.05; 9 -0.5,2.05; 10 -1,2.05
QFN28 = smd 1.15 x 0.3: P$1 -2.4,1.5; P$2 -2.4,1; P$3 -2.4,0.5; P$4 -2.4,0; P$5 -2.4,-0.5; P$6 -2.4,-1; P$7 -2.4,-1.5; P$15 2.4,-1.5; P$16 2.4,-1; P$17 2.4,-0.5; P$18 2.4,0; P$19 2.4,0.5; P$20 2.4,1; P$21 2.4,1.5 | smd 0.3 x 1.15: P$8 -1.5,-2.4; P$9 -1,-2.4; P$10 -0.5,-2.4; P$11 0,-2.4; P$12 0.5,-2.4; P$13 1,-2.4; P$14 1.5,-2.4; P$22 1.5,2.4; P$23 1,2.4; P$24 0.5,2.4; P$25 0,2.4; P$26 -0.5,2.4; P$27 -1,2.4; P$28 -1.5,2.4 | smd 3.15 x 3.15: P$29 0,0
MICROSD = smd 0.7 x 1.5: 1 9,-10.64; 2 7.9,-10.24; 3 6.8,-10.64; 4 5.7,-11.04; 5 4.6,-10.64; 6 3.5,-11.04; 7 2.4,-10.64; 8 1.3,-10.64 | smd 1.8 x 1.4: CD1 2,-0.44; CD2 8,-0.44 | smd 1.4 x 1.9: MT1 0.4,-13.54; MT2 13.6,-14.44
HC49UP = smd 5.334 x 1.93: 1 -4.826,0; 2 4.826,0

### Placement (x,y rotation side)
C1  58.42,5.08 0 top
C2  58.42,7.62 0 top
C3  134.62,13.97 180 top  (outside the outline)
C4  120.65,24.13 180 bottom  (outside the outline)
C5  120.65,26.67 180 bottom  (outside the outline)
C6  85.72,8.13 180 top
C7  78.61,18.54 180 top
C8  78.61,20.45 180 top
C9  81.92,15.24 270 top
C10  45.72,77.47 0 top
C11  73.66,82.55 90 top
C12  60.96,77.47 270 top
C13  76.2,82.55 90 top
C14  58.42,77.47 270 top
C15  82.55,83.82 0 top
C16  73.66,78.74 90 top
C17  76.2,78.74 90 top
C18  82.55,81.28 0 top
C19  69.85,66.04 0 top
C20  59.69,66.04 180 top
C21  50.8,42.55 270 top
C22  109.22,17.78 90 top  (outside the outline)
C23  13.97,83.82 0 top
C24  13.97,81.28 0 top
C25  19.05,86.36 0 top
C26  29.21,83.82 0 top
C27  29.21,81.28 0 top
C28  34.29,86.36 0 top
C29  91.44,39.37 180 top
C30  91.44,33.02 180 top
C31  67.94,13.97 270 top
C32  80.01,15.24 270 top
C33  85.72,12.06 180 top
C34  69.85,13.97 270 top
C35  85.72,10.16 180 top
C37  74.93,3.81 270 top
C38  73.03,3.81 270 top
C39  83.82,40.01 90 top
C40  74.93,40.01 90 top
C41  69.85,36.2 90 top
C42  78.74,36.2 90 top
C43  69.85,24.77 90 top
C44  72.39,24.77 90 top
C45  78.74,24.77 90 top
C46  81.28,24.77 90 top
C47  69.85,31.11 270 top
C48  78.74,31.11 270 top
C49  81.28,59.69 0 top
C50  86.36,58.42 0 top
C51  81.28,57.15 0 top
CN1  93.34,8.89 180 top
D1  134.62,19.05 270 top  (outside the outline)
D2  134.62,16.51 270 top  (outside the outline)
D3  134.62,21.59 270 top  (outside the outline)
J1  102.87,15.88 90 top
J2  50,5.08 90 top
J4  19.05,90.17 180 top
J5  34.29,90.17 180 top
J6  81.28,90.17 180 top
J7  55.88,90.17 180 top
J8  81.28,90.17 0 top
J9  55.88,90.17 0 top
J10  90.17,48.26 270 top
J11  90.17,73.66 270 top
LED3  93.34,25.4 90 top
PAD1  5,90 90 top
PAD2  95,90 270 top
R1  64.77,10.16 180 top
R2  64.77,12.7 180 top
R3  64.77,15.24 180 top
R4  64.77,17.78 180 top
R5  64.77,20.32 180 top
R6  64.77,22.86 180 top
R7  64.77,25.4 180 top
R8  64.77,27.94 180 top
R9  64.77,30.48 180 top
R10  64.77,33.02 180 top
R11  58.42,10.16 0 top
R12  64.77,35.56 180 top
R13  64.77,38.1 180 top
R14  64.77,40.64 180 top
R15  64.77,43.18 180 top
R16  64.77,45.72 180 top
R17  64.77,48.26 180 top
R18  64.77,50.8 180 top
R19  35.56,27.94 180 top
R20  35.56,30.48 180 top
R21  35.56,33.02 180 top
R22  35.56,35.56 180 top
R23  35.56,38.1 180 top
R24  35.56,40.64 180 top
R25  35.56,43.18 180 top
R26  35.56,45.72 180 top
R27  35.56,48.26 180 top
R28  35.56,50.8 180 top
R33  127,13.97 180 top  (outside the outline)
R34  127,16.51 180 top  (outside the outline)
R35  134.62,24.13 90 top  (outside the outline)
R36  132.08,24.13 90 top  (outside the outline)
R37  129.54,24.13 90 top  (outside the outline)
R38  134.62,11.43 0 top  (outside the outline)
R39  130.81,13.97 0 top  (outside the outline)
R40  127,35.56 270 bottom  (outside the outline)
R41  129.54,35.56 270 bottom  (outside the outline)
R42  132.08,35.56 270 bottom  (outside the outline)
R43  134.62,35.56 270 bottom  (outside the outline)
R44  120.65,21.59 180 bottom  (outside the outline)
R45  130.81,19.05 180 top  (outside the outline)
R46  130.81,16.51 180 top  (outside the outline)
R47  130.81,21.59 180 top  (outside the outline)
R48  76.83,3.81 90 top
R49  43.18,85.09 180 top
R50  49.53,80.01 90 top
R51  46.99,85.09 0 top
R52  46.99,80.01 90 top
R55  80.01,69.85 270 top
R56  77.47,69.85 270 top
R57  74.93,69.85 270 top
R73  80.01,82.55 90 top
R75  82.55,78.74 90 top
R76  50.55,36.2 270 top
R77  48.51,36.2 270 top
R78  42.55,36.2 270 top
R79  46.35,48.9 90 top
R81  46.48,36.2 270 top
R82  44.45,36.2 270 top
R84  114.3,17.78 270 top  (outside the outline)
R85  106.68,17.78 270 top  (outside the outline)
R86  111.76,17.78 270 top  (outside the outline)
R90  16.51,74.93 90 top
R91  19.05,74.93 90 top
R92  21.59,74.93 90 top
R93  31.75,74.93 90 top
R94  34.29,74.93 90 top
R95  36.83,74.93 90 top
R98  90.17,24.13 180 top
R99  90.17,26.67 180 top
R100  95.25,39.37 0 top
R101  95.25,33.02 0 top
R102  71.12,3.81 90 top
R103  80.9,3.81 270 top
R104  34.29,3.81 90 top
R105  83.19,5.71 180 top
R106  78.74,3.81 90 top
R107  68.58,7.62 0 top
R108  68.58,5.71 0 top
R109  68.58,9.53 0 top
R110  81.28,19.05 90 top
R111  68.58,16.51 180 top
R112  73.66,20.95 90 top
R113  68.58,18.41 180 top
R114  68.58,20.32 180 top
R115  71.75,20.95 90 top
R116  74.93,27.3 90 top
R117  83.82,27.3 90 top
R118  82.55,64.77 270 top
R119  81.28,62.23 0 top
R120  85.09,64.77 270 top
R128  49.53,90.17 180 bottom
R130  74.93,90.17 180 bottom
S2  93.34,36.2 180 top
S3  93.34,29.84 180 top
STANDOFF1  5,95 0 top
STANDOFF2  5,5 0 top
STANDOFF3  4.83,11.35 0 top
STANDOFF4  95,95 0 top
U1  50,25.4 90 top
U2  130.81,19.05 90 bottom  (outside the outline)
U3  46.99,42.55 180 top
U4  67.31,80.01 180 top
U5  44.45,81.28 270 top
U6  80.01,78.74 0 top
U7  34.29,81.28 180 top
U8  19.05,81.28 180 top
U9  86.36,60.96 90 top
U10  76.2,10.16 0 top
U11  73.66,33.66 180 top
U12  82.55,33.66 180 top
U$1  115.57,21.59 0 bottom
Y1  64.77,69.85 0 top
Y2  55.24,45.72 270 top

### Tracks (layer width: path | path; a pad name or v marks a point on that pad's centre or on a via)
3.3V  (via drill 0.6)  (8 unrouted)
  Top 0.254: U4.16 63.73,75.42 63.5,75.18 62.4,75.18 C12.2 | U5.5 44.45,77.89 C10.1 | v40.64,85.09 R49.2 | v49.53,82.3 R50.2 | R78.2 v42.55,34.04 | R76.2 50.55,35.18 v49.53,34.16 48.51,35.18 R77.2 | 48.97,40.01 U3.8 | R79.2 48.05,49.74 v48.26,49.53
  Top 0.406: U8.4 17.09,83.82 C23.2 C24.2 14.82,79.92 v14.99,79.76 | U7.4 32.33,83.82 C26.2 C27.2 30.06,79.92 v30.23,79.76 | C12.2 C14.2 58.42,75.69 v58.93,75.18 v60.2,75.18 | C21.2 v50.8,40.01 48.97,40.01
  Top 0.813: v43.18,77.47 C10.1
  other vias: 80.01,27.3 81.28,27.3 81.28,28.57 78.74,27.3
  pour Route15 (isolate 0.254): -7.62,-2.54 104.14,-2.54 104.14,102.87 -7.62,102.87
  pour Top: 77.47,24.77 77.47,28.57 80.01,28.57 80.01,31.11 82.55,31.11 82.55,27.3 83.82,27.3 83.82,24.77
5V  (via drill 0.6)  (3 unrouted)
  Top 0.254: U4.1 73.39,83.67 C11.2 | U9.9 82.9,60.46 C49.2 | U6.4 82.1,80.04 R75.2
  Top 0.406: C11.2 C13.2 77.56,83.4 | C49.2 C51.2 v83.82,57.15 v83.82,55.88 | 77.56,83.4 v77.98,83.82 | v77.98,82.55 77.98,82.98 77.56,83.4 | v81.53,85.6 81.53,83.99 C15.1 | v80.26,84.84 80.68,84.84 C15.1 | U6.4 81.03,80.11 81.03,80.52 81.7,81.19 C18.1 C15.1
  other vias: 72.39,28.57 72.39,27.3 71.12,27.3 69.85,27.3
  pour Top: 71.12,31.11 72.39,31.11 73.66,29.84 73.66,27.3 74.93,27.3 74.93,24.77 68.58,24.77 68.58,28.57 71.12,28.57
AFE_!PWDN  (1 unrouted)
AFE_!RESET  (1 unrouted)
AFE_AIN0
  Top 0.254: J6.1 J8.S 81.28,88.14 79.5,86.36 69.85,86.36 68.28,84.8 U4.6
AFE_AIN1
  Top 0.254: U4.7 67.64,84.91 69.6,86.87 77.98,86.87 78.74,87.63 J8.GND
  Bottom 0.254: J8.GND R130.2
AFE_AIN2
  Top 0.254: J7.1 J9.S 55.88,88.14 57.15,86.87 65.02,86.87 66.98,84.91 U4.8
AFE_AIN3
  Top 0.254: U4.9 66.33,84.8 64.77,86.36 54.61,86.36 53.34,87.63 J9.GND
  Bottom 0.254: R128.2 J9.GND
AIN0+
  Top 0.406: U8.3 18.41,86.14 C25.1 18.2,87.46 16.51,89.15 J4.1
AIN0-
  Top 0.406: U8.2 19.68,86.14 C25.2 19.9,87.46 21.59,89.15 J4.2
AIN1+
  Top 0.406: J5.1 31.75,89.15 33.44,87.46 C28.1 33.66,86.14 U7.3
AIN1-
  Top 0.406: J5.2 36.83,89.15 35.14,87.46 C28.2 34.92,86.14 U7.2
BT_!RESET  (3 unrouted)
BT_CONN  (2 unrouted)
BT_RESET  (2 unrouted)
BT_RXTX  (2 unrouted)
BT_STATE  (2 unrouted)
CS_AFE  (1 unrouted)
  Top 0.203: U4.20 66.33,75.14 68.83,72.64 71.88,72.64 73.66,70.87 73.66,68.33
CS_SD  (1 unrouted)
CS_TC0  (1 unrouted)
CS_TC1  (1 unrouted)
DAC0
  Top 0.254: U9.1 90.15,59.96 92.46,57.66 92.46,48.77 91.95,48.26 J10.S
DAC1
  Top 0.254: U9.2 90.18,60.46 92.46,62.74 92.46,73.15 91.95,73.66 J11.S
DAC_!CLR  (1 unrouted)
DAC_!LDAC  (1 unrouted)
GND  (via drill 0.6)  (23 unrouted)
  Top 0.254: U9.3 87.12,60.96 | 88.65,60.96 89.15,60.96 | U10.P$9 75.2,8.62 74.93,8.89 v75.56,9.53 | U10.P$13 77.2,8.62 77.47,8.89 v76.83,9.53
  other vias: 75.56,10.79 76.83,10.79 82.93,4.19
  pour Bottom (isolate 0.305, rank 6): -2.54,101.6 102.87,101.6 102.87,-2.54 -2.54,-2.54
  pour Top (isolate 0.254, rank 6): -2.54,101.6 101.6,101.6 101.6,-2.54 -2.54,-2.54
  pour Route2 (isolate 0.254): -6.35,-2.54 -6.35,105.41 104.14,105.41 104.14,-5.08 -6.35,-5.08
LED0  (1 unrouted)
LED1  (1 unrouted)
MICRO_!RESET  (3 unrouted)
MISO  (4 unrouted)
MOSI  (3 unrouted)
N$1
  Top 0.203: U1.4 R1.2
N$2
  Top 0.203: U1.5 R2.2
N$3
  Top 0.203: U1.6 R3.2
N$4
  Top 0.203: U1.7 R4.2
N$5
  Top 0.203: U1.8 R5.2
N$6
  Top 0.203: U1.9 R6.2
N$7
  Top 0.203: U1.10 R7.2
N$8
  Top 0.813: U1.2 C1.2 C2.2 R11.2
N$9
  Top 0.203: U1.11 R8.2
N$10
  Top 0.203: U1.12 R9.2
N$11
  Top 0.203: U1.13 R10.2
N$12
  Top 0.203: U1.14 R12.2
N$13
  Top 0.203: U1.30 R19.1
N$14
  Top 0.203: U1.15 R13.2
N$15
  Top 0.203: U1.29 R20.1
N$16
  Top 0.203: U1.28 R21.1
N$17
  Top 0.203: U1.27 R22.1
N$18
  Top 0.203: U1.26 R23.1
N$19
  Top 0.203: U1.25 R24.1
N$20
  Top 0.203: U1.16 R14.2
N$21
  Top 0.203: U1.17 R15.2
N$22
  Top 0.203: U1.18 R16.2
N$23
  Top 0.203: U1.19 R17.2
N$24
  Top 0.203: U1.20 R18.2
N$25
  Top 0.203: U1.24 R25.1
N$26
  Top 0.203: U1.23 R26.1
N$27
  Top 0.203: U1.22 R27.1
N$28
  Top 0.203: U1.21 R28.1
N$33  (1 unrouted)
N$34  (1 unrouted)
N$35  (1 unrouted)
N$36  (1 unrouted)
N$37  (1 unrouted)
N$39  (1 unrouted)
N$40  (1 unrouted)
N$41  (1 unrouted)
N$42  (1 unrouted)
N$43  (1 unrouted)
N$44  (1 unrouted)
N$45  (1 unrouted)
N$46  (1 unrouted)
N$47
  Top 0.203: U5.1 45.45,84.4 R51.1
  Top 0.254: R49.1 R51.1
N$48
  Top 0.203: U5.6 46.77,79.38 R52.1
  Top 0.254: R50.1 R52.1
N$51
  Top 0.203: U4.24 68.94,74.83 69.6,74.17 76.54,74.17 R55.1
N$52
  Top 0.203: U4.23 68.28,74.72 69.34,73.66 74.51,73.66 R56.1
N$53
  Top 0.203: U4.22 67.64,74.61 69.09,73.15 72.48,73.15 R57.1
N$69
  Top 0.254: U4.4 69.58,84.57 70.1,85.09 78.32,85.09 R73.2
N$71
  Top 0.254: U6.3 82.1,77.44 R75.1
N$72
  Top 0.254: C20.1 60.54,69.25 Y1.1 64.52,69.85 65.03,70.37 U4.18
N$73
  Top 0.254: C19.1 69,69.25 69.22,69.47 | 69.22,69.47 Y1.2 | U4.19 65.69,70.2 66.04,69.85 68.83,69.85 69.22,69.47
N$74
  Top 0.254: U3.2 47.62,46.99 48.26,47.62 53.98,47.62 55.24,48.9 Y2.1
N$75
  Top 0.254: Y2.2 55.24,42.55 52.7,45.09 48.97,45.09 U3.1
N$77
  Top 0.254: U3.6 46.48,39.8 R81.1 R77.1
N$78
  Top 0.254: U3.5 45.09,37.68 R82.1 R78.1
N$81  (1 unrouted)
N$82  (1 unrouted)
N$83  (1 unrouted)
N$86
  Top 0.254: U8.7 19.68,77.34 20.32,76.71 20.66,76.71 R92.2
N$87
  Top 0.254: U8.6 18.41,76.42 R91.2
N$88
  Top 0.254: U8.5 17.14,76.42 R90.2
N$89
  Top 0.254: U7.7 34.92,77.09 35.56,76.45 36.16,76.45 R95.2
N$90
  Top 0.254: U7.6 33.66,76.42 R94.2
N$91
  Top 0.254: U7.5 32.38,76.42 R93.2
N$92  (1 unrouted)
N$93  (1 unrouted)
N$97  (1 unrouted)
  Top 0.254: U10.P$14 78.35,7.76 80.9,5.21 R103.1 80.86,4.66 79.88,3.68 79.88,2.29 80.14,2.03 82.04,2.03
N$98
  Top 0.254: U10.P$16 80.25,9.16 81.15,8.26 81.15,7.49 81.66,6.99 84.84,6.99 85.22,6.6 85.22,4.32 83.82,2.92 80.94,2.92 R103.2
N$99
  Top 0.254: U10.P$15 79.73,8.66 80.39,8 80.39,6.86 81.53,5.71 R105.2
N$100
  Top 0.254: U10.P$12 76.7,6.7 R106.2
N$101
  Top 0.254: U10.P$5 71.51,9.66 70.74,8.89 70.74,8 70.36,7.62 R107.2
N$102
  Top 0.254: U10.P$6 71.9,9.16 71.37,8.64 71.37,7.66 R108.2
N$103
  Top 0.254: U10.P$4 71.12,10.16 70.48,9.53 R109.2
N$104
  Top 0.254: U10.P$11 76.2,5.29 R48.2
N$105
  Top 0.254: U10.P$7 72.16,8.66 71.88,8.38 71.88,7.24 71.12,6.48 R102.2
N$106
  Top 0.254: U10.P$8 73.67,7.76 73.03,7.11 C38.1
N$107
  Top 0.254: U10.P$10 75.7,6.74 74.93,5.97 C37.1
N$109
  Top 0.254: U10.P$22 77.7,15.72 79.12,17.14 80.22,17.14 R110.1
N$110
  Top 0.254: U10.P$1 73.8,11.93 71.12,14.61 71.12,15.88 70.48,16.51 R111.1
N$111
  Top 0.254: U10.P$25 76.2,14.35 73.66,16.89 R112.1
N$112
  Top 0.254: U10.P$28 74.05,12.56 71.75,14.86 71.75,16.09 R113.1
N$113
  Top 0.254: U10.P$27 75.2,13.45 74.93,13.72 73.79,13.72 72.39,15.11 72.39,16.38 70.48,18.29 70.48,19.27 R114.1
N$114
  Top 0.254: U10.P$26 75.7,13.96 71.75,17.91 R115.1
N$115
  Top 0.406: U11.1 75.56,38.52 C40.1
N$116
  Top 0.406: U12.1 84.45,38.52 C39.1
N$117
  Top 0.406: U11.7 74.3,28.79 R116.2
N$118
  Top 0.406: U12.7 83.19,28.79 R117.2
N$119
  Top 0.203: U9.7 83.57,61.46 83.31,61.72 83.31,63.16 R118.2
N$120
  Top 0.203: U9.8 83.4,60.96 R119.2
N$121
  Top 0.203: U9.6 84.31,63.14 R120.2
N$124
  Top 0.254: U9.10 84.31,59.62 C50.1
RTC_!INTA  (1 unrouted)
  Top 0.254: U3.3 R79.1
RTC_SQW  (1 unrouted)
  Top 0.254: U3.7 47.62,38.73 48.26,38.1 49.49,38.1 R76.1
SCK  (5 unrouted)
SCL  (2 unrouted)
  Top 0.203: R52.2 46.99,82.55 48.26,83.82 50.8,83.82
SD_CD  (1 unrouted)
SDA  (2 unrouted)
  Top 0.203: R51.2 50.8,85.09
SW2  (3 unrouted)
VBATT  (via drill 0.6)
  Top 0.254: 78.74,12.45 78.74,11.68 78.72,11.66 U10.P$21 U10.P$20 | 78.66,11.66 79.73,11.66 79.73,11.58 79.32,11.18 78.64,11.18
  Bottom 1.27: CN1.1 87.63,8.89 85.09,11.43 v85.09,13.97
  other vias: 85.09,15.24 83.82,13.97 83.82,15.24
  pour Top (isolate 0.254): 78.74,11.43 78.74,14.61 79.38,15.24 85.72,15.24 85.72,13.34 82.55,13.34 80.64,11.43
  pour Top (isolate 0.254): 85.72,13.34 85.72,15.88 83.19,15.88 83.19,13.34
  pour Bottom (isolate 0.254): 83.19,15.88 83.19,13.34 85.72,13.34 85.72,15.88
VIN  (via drill 0.6)  (1 unrouted)
  Top 0.254: 72.14,10.67 72.14,10.66 U10.P$3 | U10.P$2 72.03,11.16 v71.75,11.43
  other vias: 70.48,11.43 69.22,11.43 67.94,11.43
  pour Top: 67.31,10.67 67.31,13.97 71.12,13.97 73.41,11.68 73.41,10.67
VLDO  (via drill 0.6)
  Top 0.254: U10.P$17 80.89,9.66 82.3,8.13 v83.19,8.13 C6.2 | R110.2 82.46,19.9 82.93,19.43 v82.93,17.53 | R111.2 R113.2 R114.2 67.73,21.38 68.45,22.1 v70.1,22.1 71.37,22.1 71.67,21.8 R115.2 R112.2
  Bottom 0.254: v82.93,17.53 81.92,16.51 81.92,16.38 | 81.92,16.38 81.92,9.4 v83.19,8.13 | v70.1,22.1 70.1,21.34 74.93,16.51 81.79,16.51 81.92,16.38
VREF_2V5
  Top 0.406: C16.1 C17.1 77.13,77.89 77.98,78.74 77.98,80.01 78.01,80.04 U6.5 79.06,80.75 R73.1
VSYS  (via drill 0.6)  (3 unrouted)
  Top 0.254: U10.P$23 77.2,17.09 C7.2 | 76.71,12.7 76.71,13.59
  Top 0.406: U11.4 71.75,34.29 v72.39,33.66 v73.66,33.66 v74.93,33.66 75.56,33.02 | U11.8 75.56,33.02 | U12.4 80.64,34.29 | 80.64,34.29 v81.28,33.66 v82.55,33.66 v83.82,33.66 84.45,33.02 U12.8 | 80.64,34.29 78.11,34.29 75.56,33.02
  other vias: 77.47,33.66 78.74,33.66 76.2,20.32 76.2,19.05 76.2,17.78
  pour Top (isolate 0.254): 68.58,34.92 85.09,34.92 85.09,32.38 68.58,32.38
  pour Bottom (isolate 0.254): 68.58,34.92 68.58,32.38 85.09,32.38 85.09,34.92
  pour Top: 77.22,12.7 77.22,16.38 78.23,17.4 78.23,21.72 75.18,21.72 75.18,17.14 76.71,15.62 76.71,12.7
VUSB  (via drill 0.6)  (1 unrouted)
  Top 0.254: U10.P$18 v83.19,10.16 | 78.87,10.67 79.76,10.67
  other vias: 83.19,12.06
  pour Top (isolate 0.254): 78.11,10.16 78.11,10.79 85.72,10.79 85.72,9.53 81.28,9.53 81.28,10.16
  pour Top (isolate 0.254): 80.64,10.79 82.55,12.7 85.72,12.7 85.72,9.53 81.28,9.53 81.28,10.16 80.64,10.16